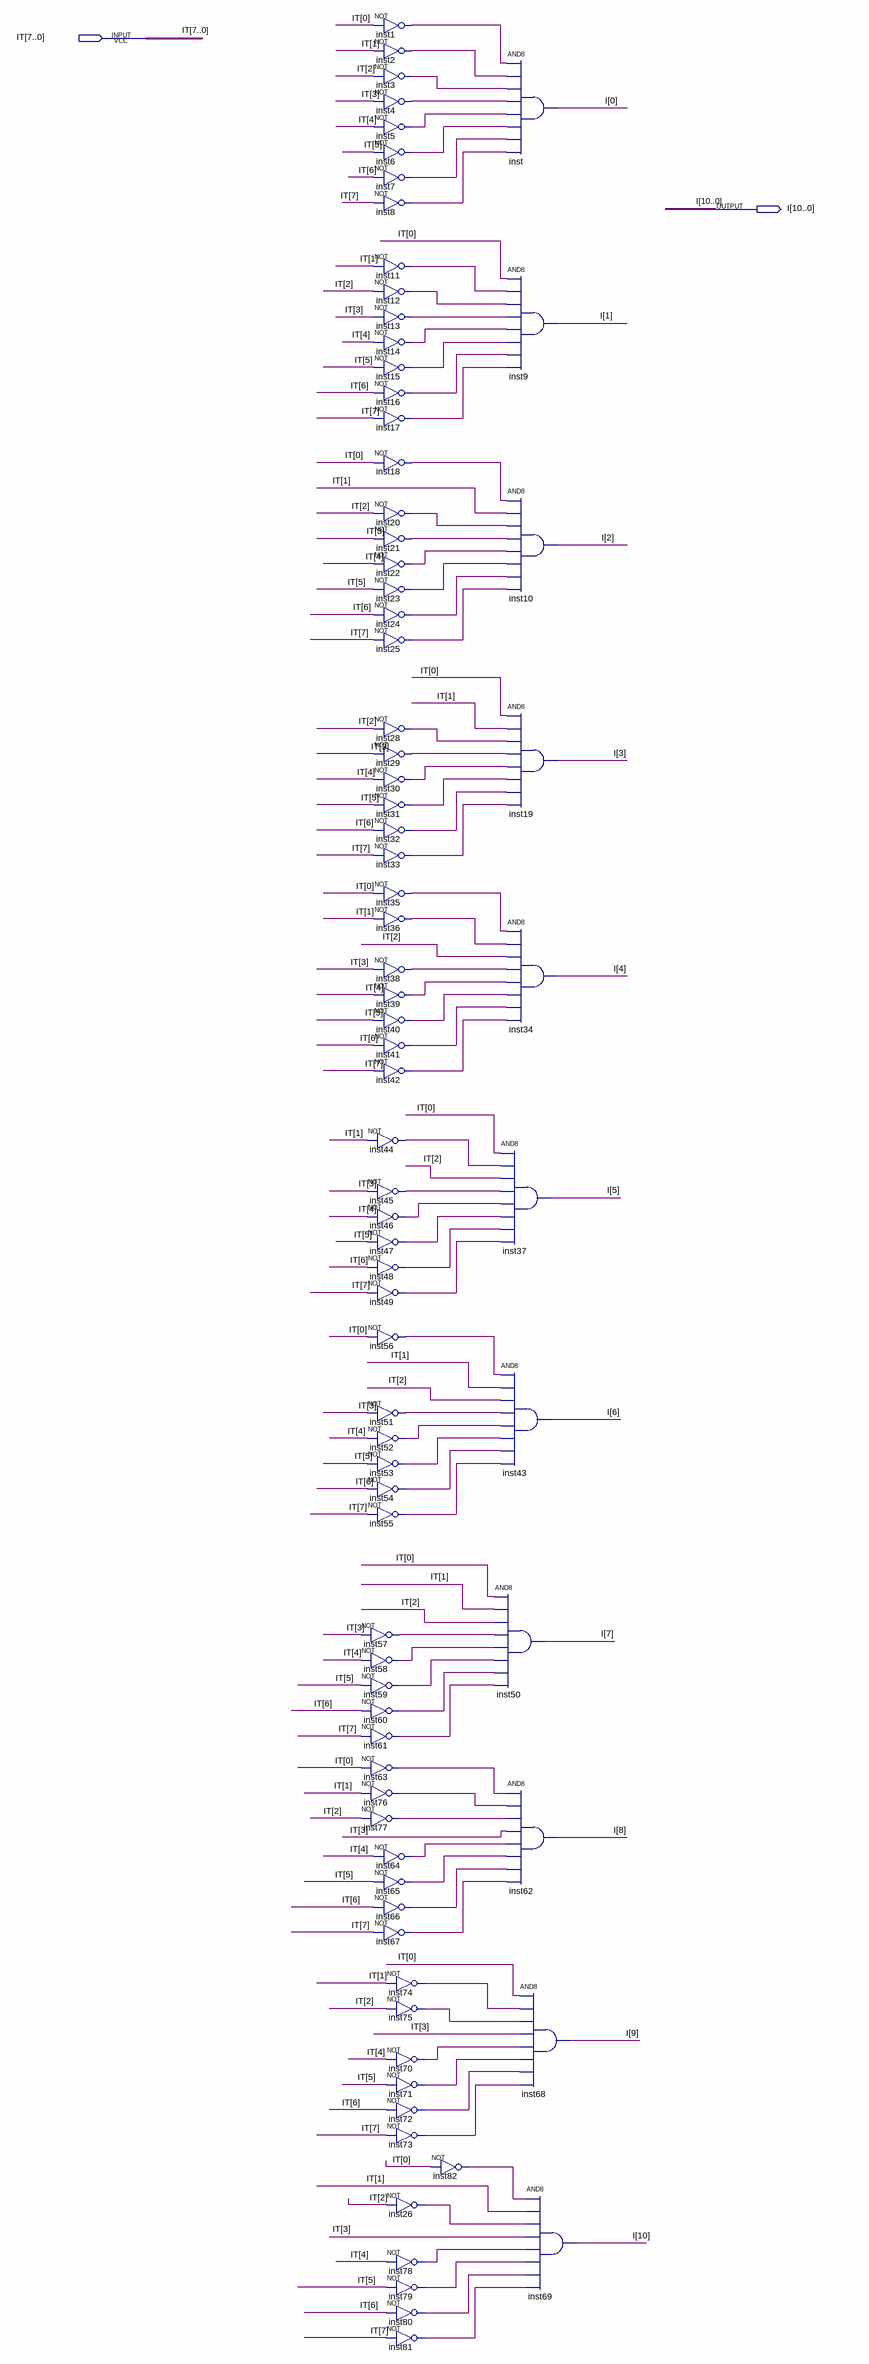
[diagram p0: schematic sheet]
// Quartus schematic DECO.bdf as structural Verilog: 82 symbols, 2 pins
module DECO (
  input  [7:0] IT,
  output [10:0] I
);

  wire inst1_out, inst2_out, inst3_out, inst4_out, inst5_out, inst6_out, inst7_out, inst8_out, inst11_out,
       inst12_out, inst13_out, inst14_out, inst15_out, inst16_out, inst17_out, inst18_out, inst20_out,
       inst21_out, inst22_out, inst23_out, inst24_out, inst25_out, inst26_out, inst28_out, inst29_out,
       inst30_out, inst31_out, inst32_out, inst33_out, inst35_out, inst36_out, inst38_out, inst39_out,
       inst40_out, inst41_out, inst42_out, inst44_out, inst45_out, inst46_out, inst47_out, inst48_out,
       inst49_out, inst51_out, inst52_out, inst53_out, inst54_out, inst55_out, inst56_out, inst57_out,
       inst58_out, inst59_out, inst60_out, inst61_out, inst63_out, inst64_out, inst65_out, inst66_out,
       inst67_out, inst70_out, inst71_out, inst72_out, inst73_out, inst74_out, inst75_out, inst76_out,
       inst77_out, inst78_out, inst79_out, inst80_out, inst81_out, inst82_out;

  not inst44 (inst44_out, IT[1]);
  not inst45 (inst45_out, IT[3]);
  not inst46 (inst46_out, IT[4]);
  not inst47 (inst47_out, IT[5]);
  not inst48 (inst48_out, IT[6]);
  not inst49 (inst49_out, IT[7]);
  not inst56 (inst56_out, IT[0]);
  not inst51 (inst51_out, IT[3]);
  not inst52 (inst52_out, IT[4]);
  not inst53 (inst53_out, IT[5]);
  not inst54 (inst54_out, IT[6]);
  not inst55 (inst55_out, IT[7]);
  not inst57 (inst57_out, IT[3]);
  not inst58 (inst58_out, IT[4]);
  not inst59 (inst59_out, IT[5]);
  not inst60 (inst60_out, IT[6]);
  not inst61 (inst61_out, IT[7]);
  not inst63 (inst63_out, IT[0]);
  not inst76 (inst76_out, IT[1]);
  not inst77 (inst77_out, IT[2]);
  not inst1 (inst1_out, IT[0]);
  not inst2 (inst2_out, IT[1]);
  not inst3 (inst3_out, IT[2]);
  not inst4 (inst4_out, IT[3]);
  not inst5 (inst5_out, IT[4]);
  not inst6 (inst6_out, IT[5]);
  not inst7 (inst7_out, IT[6]);
  not inst8 (inst8_out, IT[7]);
  not inst11 (inst11_out, IT[1]);
  not inst12 (inst12_out, IT[2]);
  not inst13 (inst13_out, IT[3]);
  not inst14 (inst14_out, IT[4]);
  not inst15 (inst15_out, IT[5]);
  not inst16 (inst16_out, IT[6]);
  not inst17 (inst17_out, IT[7]);
  not inst18 (inst18_out, IT[0]);
  not inst20 (inst20_out, IT[2]);
  not inst21 (inst21_out, IT[3]);
  not inst22 (inst22_out, IT[4]);
  not inst23 (inst23_out, IT[5]);
  not inst24 (inst24_out, IT[6]);
  not inst25 (inst25_out, IT[7]);
  not inst28 (inst28_out, IT[2]);
  not inst29 (inst29_out, IT[3]);
  not inst30 (inst30_out, IT[4]);
  not inst31 (inst31_out, IT[5]);
  not inst32 (inst32_out, IT[6]);
  not inst33 (inst33_out, IT[7]);
  not inst35 (inst35_out, IT[0]);
  not inst36 (inst36_out, IT[1]);
  not inst38 (inst38_out, IT[3]);
  not inst39 (inst39_out, IT[4]);
  not inst40 (inst40_out, IT[5]);
  not inst41 (inst41_out, IT[6]);
  not inst42 (inst42_out, IT[7]);
  not inst64 (inst64_out, IT[4]);
  not inst65 (inst65_out, IT[5]);
  not inst66 (inst66_out, IT[6]);
  not inst67 (inst67_out, IT[7]);
  not inst74 (inst74_out, IT[1]);
  not inst75 (inst75_out, IT[2]);
  not inst70 (inst70_out, IT[4]);
  not inst71 (inst71_out, IT[5]);
  not inst72 (inst72_out, IT[6]);
  not inst73 (inst73_out, IT[7]);
  not inst26 (inst26_out, IT[2]);
  not inst78 (inst78_out, IT[4]);
  not inst79 (inst79_out, IT[5]);
  not inst80 (inst80_out, IT[6]);
  not inst81 (inst81_out, IT[7]);
  not inst82 (inst82_out, IT[0]);
  and inst (I[0], inst1_out, inst2_out, inst3_out, inst4_out, inst5_out, inst6_out, inst7_out, inst8_out);
  and inst9 (I[1], IT[0], inst11_out, inst12_out, inst13_out, inst14_out, inst15_out, inst16_out, inst17_out);
  and inst10 (I[2], inst18_out, IT[1], inst20_out, inst21_out, inst22_out, inst23_out, inst24_out, inst25_out);
  and inst19 (I[3], IT[0], IT[1], inst28_out, inst29_out, inst30_out, inst31_out, inst32_out, inst33_out);
  and inst34 (I[4], inst35_out, inst36_out, IT[2], inst38_out, inst39_out, inst40_out, inst41_out, inst42_out);
  and inst37 (I[5], IT[0], inst44_out, IT[2], inst45_out, inst46_out, inst47_out, inst48_out, inst49_out);
  and inst43 (I[6], inst56_out, IT[1], IT[2], inst51_out, inst52_out, inst53_out, inst54_out, inst55_out);
  and inst50 (I[7], IT[0], IT[1], IT[2], inst57_out, inst58_out, inst59_out, inst60_out, inst61_out);
  and inst62 (I[8], inst63_out, inst76_out, inst77_out, IT[3], inst64_out, inst65_out, inst66_out, inst67_out);
  and inst68 (I[9], IT[0], inst74_out, inst75_out, IT[3], inst70_out, inst71_out, inst72_out, inst73_out);
  and inst69 (I[10], inst82_out, IT[1], inst26_out, IT[3], inst78_out, inst79_out, inst80_out, inst81_out);
endmodule
